# Altium schematic sheet 5V_Regulator.SchDoc
size A
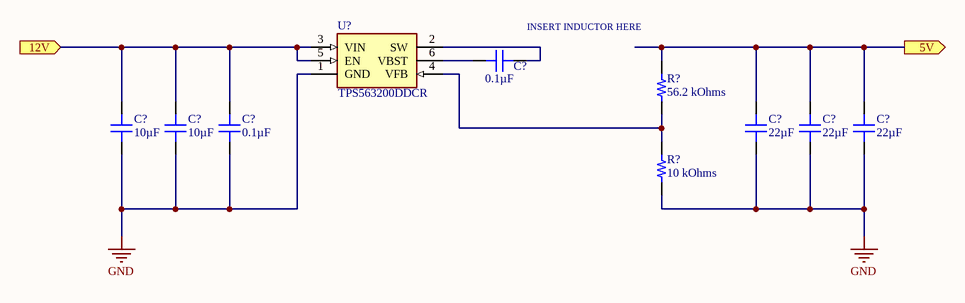
[diagram p0: 5V_Regulator.SchDoc]

## Parts
(Parts that share a designator on the sheet are numbered #1, #2 ... from top to bottom, then left to right.)
C?#1  0.1µF  [CAP 0805_2012]
C?#2  10µF  [CAP 0805_2012]
C?#3  10µF  [CAP 0805_2012]
C?#4  0.1µF  [CAP 0805_2012]
C?#5  22µF  [CAP 0805_2012]
C?#6  22µF  [CAP 0805_2012]
C?#7  22µF  [CAP 0805_2012]
R?#1  56.2 kOhms  [RES 0603_1608]
R?#2  10 kOhms  [RES 0603_1608]
U?  TPS563200DDCR  [SOT95P280X110-6N]

## Ports
5V (out), 12V (in)

## Nets
GND: C?#2.1 C?#3.1 C?#4.1 C?#5.1 C?#6.1 C?#7.1 R?#2.1 U?.1(GND)
5V: C?#5.2 C?#6.2 C?#7.2 R?#1.2 ; port 5V
12V: C?#2.2 C?#3.2 C?#4.2 U?.3(VIN) U?.5(EN) ; port 12V
NetC?#1_1: C?#1.1 U?.6(VBST)
NetC?#1_2: C?#1.2 U?.2(SW)
NetR?#1_1: R?#1.1 R?#2.2 U?.4(VFB)

## Notes on the sheet
- (near C?#1) INSERT INDUCTOR HERE

## Library data of the parts
C?#1 C?#4 = UMK212B7104KG-T: CAP CER 0.1UF 50V X7R 0805; Manufacturer: Taiyo Yuden; Tolerance: ±10%; Part Number: UMK212B7104KG-T; Value: 0.1µF; Applications: General Purpose; Capacitance: 0.1µF; ComponentLink1Description: Datasheet; ComponentLink1URL: https://www.yuden.co.jp/productdata/catalog/mlcc01_e.pdf; ComponentLink2Description: DigiKey Link; ComponentLink2URL: http://digikey.com/product-detail/en/taiyo-yuden/UMK212B7104KG-T/587-1279-1-ND/931056; Device Package: 0805 (2012 Metric); LastUpdated: 1/21/2020 12:03:02 AM; Lifecycle Status: Active; Minimum Order: 1; Mounting Type: Surface Mount, MLCC; Operating Temperature: -55°C ~ 125°C; Package / Case: 0805 (2012 Metric); Packaging: TapeAndReel; PartId: 4985; Part Status: Active; Price: 0.02; Series: M; Size / Dimension: 0.079" L x 0.049" W (2.00mm x 1.25mm); Supplier 1: DigiKey; Supplier Part Number 1: 587-1279-1-ND; Temperature Coefficient: X7R; Thickness (Max): 0.053" (1.35mm); Voltage - Rated: 50V
C?#2 C?#3 = TMK212BBJ106KGHT: CAP CER 10UF 25V X5R 0805; Manufacturer: Taiyo Yuden; Tolerance: ±10%; Part Number: TMK212BBJ106KGHT; Value: 10µF; Applications: Automotive; Capacitance: 10µF; ComponentLink1Description: Datasheet; ComponentLink1URL: https://www.yuden.co.jp/productdata/catalog/mlcc_all_hq_e.pdf; ComponentLink2Description: DigiKey Link; ComponentLink2URL: http://digikey.com/product-detail/en/taiyo-yuden/TMK212BBJ106KGHT/587-4334-1-ND/5400908; Device Package: 0805 (2012 Metric); LastUpdated: 1/21/2020 12:03:03 AM; Lifecycle Status: Active; Minimum Order: 1; Mounting Type: Surface Mount, MLCC; Operating Temperature: -55°C ~ 85°C; Package / Case: 0805 (2012 Metric); Packaging: TapeAndReel; PartId: 4818; Part Status: Active; Price: 0.07; Ratings: AEC-Q200; Series: M; Size / Dimension: 0.079" L x 0.049" W (2.00mm x 1.25mm); Supplier 1: DigiKey; Supplier Part Number 1: 587-4334-1-ND; Temperature Coefficient: X5R; Thickness (Max): 0.053" (1.35mm); Voltage - Rated: 25V
C?#5-C?#7 = LMK212BBJ226MG-T: CAP CER 22UF 10V X5R 0805; Manufacturer: Taiyo Yuden; Tolerance: ±20%; Part Number: LMK212BBJ226MG-T; Value: 22µF; Applications: SMPS Filtering; Capacitance: 22µF; ComponentLink1Description: Datasheet; ComponentLink1URL: https://ds.yuden.co.jp/TYCOMPAS/ut/detail?pn=LMK212BBJ226MG-T &u=M; ComponentLink2Description: DigiKey Link; ComponentLink2URL: http://digikey.com/product-detail/en/taiyo-yuden/LMK212BBJ226MG-T/587-5464-1-ND/7067140; Device Package: 0805 (2012 Metric); LastUpdated: 1/21/2020 12:02:43 AM; Lifecycle Status: Active; Minimum Order: 1; Mounting Type: Surface Mount, MLCC; Operating Temperature: -55°C ~ 85°C; Package / Case: 0805 (2012 Metric); Packaging: TapeAndReel; PartId: 16243; Part Status: Active; Price: 0.06; Series: M; Size / Dimension: 0.079" L x 0.049" W (2.00mm x 1.25mm); Supplier 1: DigiKey; Supplier Part Number 1: 587-5464-1-ND; Temperature Coefficient: X5R; Thickness (Max): 0.057" (1.45mm); Voltage - Rated: 10V
R?#1 = RMCF0603FT56K2: RES 56.2K OHM 1% 1/10W 0603; Manufacturer: Stackpole Electronics Inc; Power (Watts): 0.1W, 1/10W; Temperature Coefficient: ±100ppm/°C; Part Number: RMCF0603FT56K2; Value: 56.2 kOhms; ComponentLink1Description: Datasheet; ComponentLink1URL: https://www.seielect.com/catalog/sei-rmcf_rmcp.pdf; ComponentLink2Description: DigiKey Link; ComponentLink2URL: http://digikey.com/product-detail/en/stackpole-electronics-inc/RMCF0603FT56K2/RMCF0603FT56K2CT-ND/1943105; Composition: Thick Film; Device Package: 0603 (1608 Metric); Features: Automotive AEC-Q200; Height - Seated (Max): 0.022" (0.55mm); LastUpdated: 1/21/2020 12:22:37 AM; Lifecycle Status: Active; Minimum Order: 1; Number of Terminations: 2; Operating Temperature: -55°C ~ 155°C; Package / Case: 0603 (1608 Metric); Packaging: CutTape; PartId: 10739; Part Status: Active; Price: 0.10; Ratings: AEC-Q200; Resistance: 56.2 kOhms; Series: RMCF; Size / Dimension: 0.061" L x 0.031" W (1.55mm x 0.80mm); Supplier 1: DigiKey; Supplier Part Number 1: RMCF0603FT56K2CT-ND; Supplier Device Package: 0603; Tolerance: ±1%
R?#2 = TNPW060310K0FHTA: RES 10K OHM 1% 1/10W 0603; Manufacturer: Vishay Dale; Power (Watts): 0.1W, 1/10W; Temperature Coefficient: ±50ppm/°C; Part Number: TNPW060310K0FHTA; Value: 10 kOhms; ComponentLink2Description: DigiKey Link; ComponentLink2URL: http://digikey.com/product-detail/en/vishay-dale/TNPW060310K0FHTA/541-3906-1-ND/7355264; Composition: Thin Film; Device Package: 0603 (1608 Metric); Features: Military; Height - Seated (Max): 0.022" (0.55mm); LastUpdated: 1/21/2020 12:23:11 AM; Lifecycle Status: Active; Minimum Order: 1; Number of Terminations: 2; Operating Temperature: -55°C ~ 125°C; Package / Case: 0603 (1608 Metric); Packaging: TapeAndReel; PartId: 9361; Part Status: Active; Price: 0.07; Resistance: 10 kOhms; Series: TNPW; Size / Dimension: 0.063" L x 0.033" W (1.60mm x 0.85mm); Supplier 1: DigiKey; Supplier Part Number 1: 541-3906-1-ND; Supplier Device Package: 0603; Tolerance: ±1%
U? = TPS563200DDCR: Buck Switching Regulator IC Positive Adjustable 0.76V 1 Output 3A SOT-23-6 Thin, TSOT-23-6; MF: Texas Instruments; Package: TSOT-23 Texas Instruments; Value: *; Price: None; MP: TPS563200DDCR; SnapEDA_Link: https://www.snapeda.com/parts/TPS563200DDCR/Texas%20Instruments/view-part/71685/?ref=snap; Availability: Unavailable